# EAGLE design ng-beacon-mdbt42 (EAGLE 7.6.0)
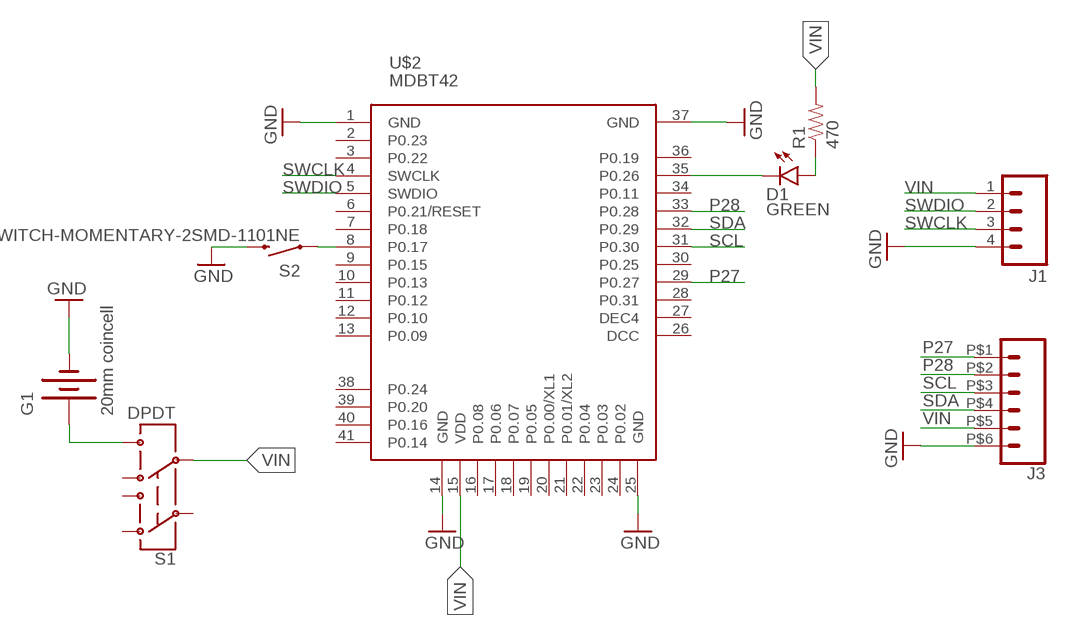
[diagram p0: schematic, sheet 1]

## Parts
D1  GREEN  LED-GREEN0603  [LED-0603]
G1  20mm coincell  BATTERY20MM_4LEGS  [BATTCON_20MM_4LEGS]
J1  M04LOCK  [1X04_LOCK]
J3  CONN_06  [PROTO4X6]
R1  470  470OHM1/10W1%(0603)  [0603-RES]
S1  DPDT  SWITCH-DPDTAYZ0202  [AYZ0202]
S2  SWITCH-MOMENTARY-2SMD-1101NE  [TACTILE-SWITCH-1101NE]
U$2  MDBT42  [MDBT42]

## Nets
GND: G1.NEGATIVE(-) J1.4 J3.P$6 S2.2 U$2.1(GND) U$2.14(GND) U$2.25(GND) U$2.37(GND)
N$1: G1.POSITIVE@1(+) G1.POSITIVE@2(+) G1.POSITIVE@3(+) G1.POSITIVE@4(+) S1.6
N$4: S2.1 U$2.8(P0.17)
N$7: D1.C U$2.35(P0.26)
N$8: D1.A R1.1
P27: J3.P$1 U$2.29(P0.27)
P28: J3.P$2 U$2.33(P0.28)
SCL: J3.P$3 U$2.31(P0.30)
SDA: J3.P$4 U$2.32(P0.29)
SWCLK: J1.3 U$2.4(SWCLK)
SWDIO: J1.2 U$2.5(SWDIO)
VIN: J1.1 J3.P$5 R1.2 S1.5 U$2.15(VDD)
Unconnected: S1.1 S1.2 S1.3 S1.4 U$2.2(P0.23) U$2.3(P0.22) U$2.6(P0.21/RESET) U$2.7(P0.18) U$2.9(P0.15) U$2.10(P0.13) U$2.11(P0.12) U$2.12(P0.10) U$2.13(P0.09) U$2.16(P0.08) U$2.17(P0.06) U$2.18(P0.07) U$2.19(P0.05) U$2.20(P0.00/XL1) U$2.21(P0.01/XL2) U$2.22(P0.04) U$2.23(P0.03) U$2.24(P0.02) U$2.26(DCC) U$2.27(DEC4) U$2.28(P0.31) U$2.30(P0.25) U$2.34(P0.11) U$2.36(P0.19) U$2.38(P0.24) U$2.39(P0.20) U$2.40(P0.16) U$2.41(P0.14)

## Library data of the parts
D1 = SparkFun-LED:LED-GREEN: Various green LEDs Green LEDs used in SFE Production 0603- DIO-00821 LARGE- DIO-00862 LILYPAD- DIO-09910; PROD_ID: DIO-00821
G1 = ng-beacon:BATTERY: Battery Holders Various common sizes : AA, AAA, 18650 (PRT-12895), 20mm coin cell and 12mm coin cell. 20MM_4LEGS, BATT-10373; PROD_ID: BATT-10373
J1 = SparkFun-Connectors:M04: Header 4 Standard 4-pin 0.1" header. Use with straight break away headers (SKU : PRT-00116), right angle break away headers (PRT-00553), swiss pins (PRT-00743), machine pins (PRT-00117), and female headers (PRT-00115). Molex polarized connector foot print use with SKU : PRT-08231 with associated crimp pins and housings. 1MM SMD Version SKU: PRT-10208; PROD_ID: CONN-09696
J3 = ng-beacon:CONN_06: Multi connection point. Often used as Generic Header-pin footprint for 0.1 inch spaced/style header connections On any of the 0.1 inch spaced packages, you can populate with these: Break Away Headers - Straight <https://www.sparkfun.com/products/116> (PRT-00116) Break Away Male Headers - Right Angle <https://www.sparkfun.com/products/553> (PRT-00553) Female Headers <https://www.sparkfun.com/products/115> (PRT-00115) Break Away Headers - Machine Pin <https://www.sparkfun.com/products/117> (PRT-00117) Break Away Female Headers - Swiss Machine Pin <https://www.sparkfun.com/products/743> (PRT-00743) Arduino Stackable Header - 6 Pin <https://www.sparkfun.com/products/9280> (PRT-09280) For SCREWTERMINALS and SPRING TERMINALS visit here: Screw Terimnals on SparkFun.com <https://www.sparkfun.com/search/results?term=Screw+Terminals> (5mm/3.5mm/2.54mm spacing) This device is also useful as a general connection point to wire up your design to another part of your project. Our various solder wires solder well into these plated through hole pads. Hook-Up Wire - Assortment (Stranded, 22 AWG) <https://www.sparkfun.com/products/11375> (PRT-11375) Hook-Up Wire - Assortment (Solid Core, 22 AWG) <https://www.sparkfun.com/products/11367> (PRT-11367) View the entire wire category on our website here <https://www.sparkfun.com/categories/141>
R1 = SparkFun-Resistors:470OHM1/10W1%(0603): RES-07869; PROD_ID: RES-07869
S1 = ng-beacon:SWITCH-DPDT: DPDT Version of the COM-00597; PROD_ID: SWCH-08179
S2 = SparkFun-Electromechanical:SWITCH-MOMENTARY-2: Various NO switches- pushbuttons, reed, etc; PROD_ID: SWCH-00815
U$2 = MDBT42:MDBT42: Raytac Corporation MDBT42-512K, MDBT42-P512K Bluetooth Low Energy Module based on Noridc nRF52832 Source: Raytac datasheet

## Board
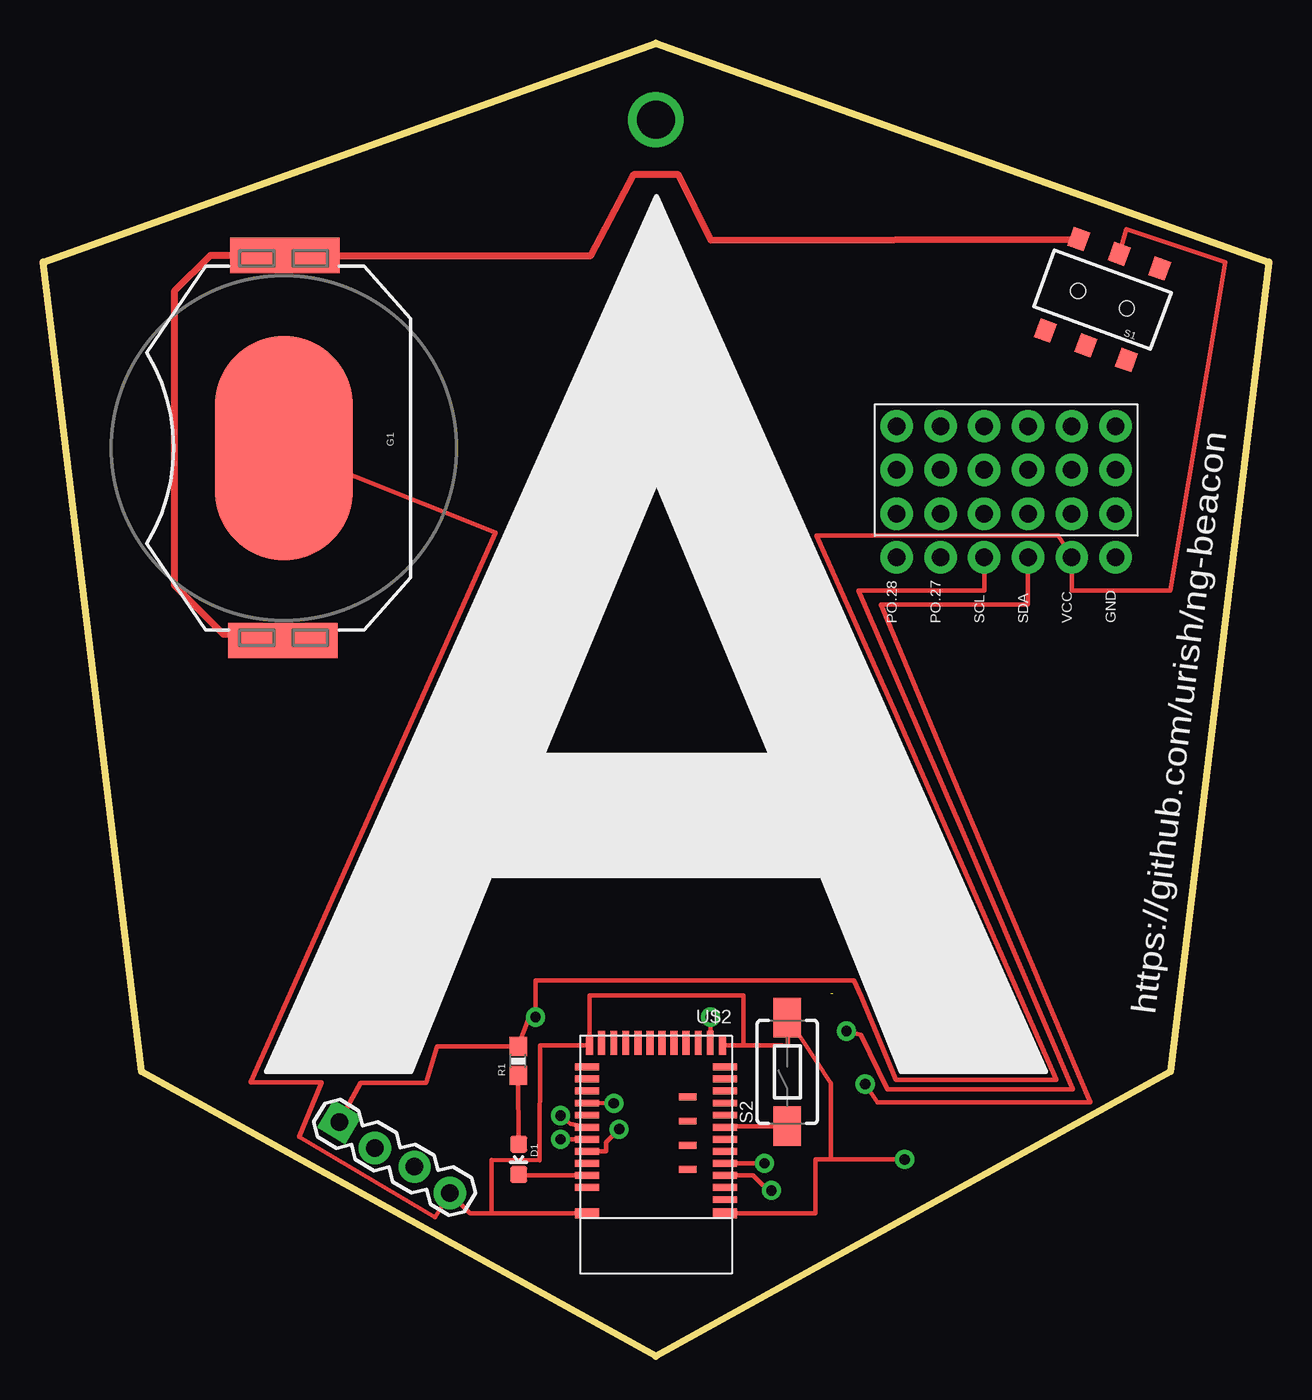
[diagram p1: board, top side]
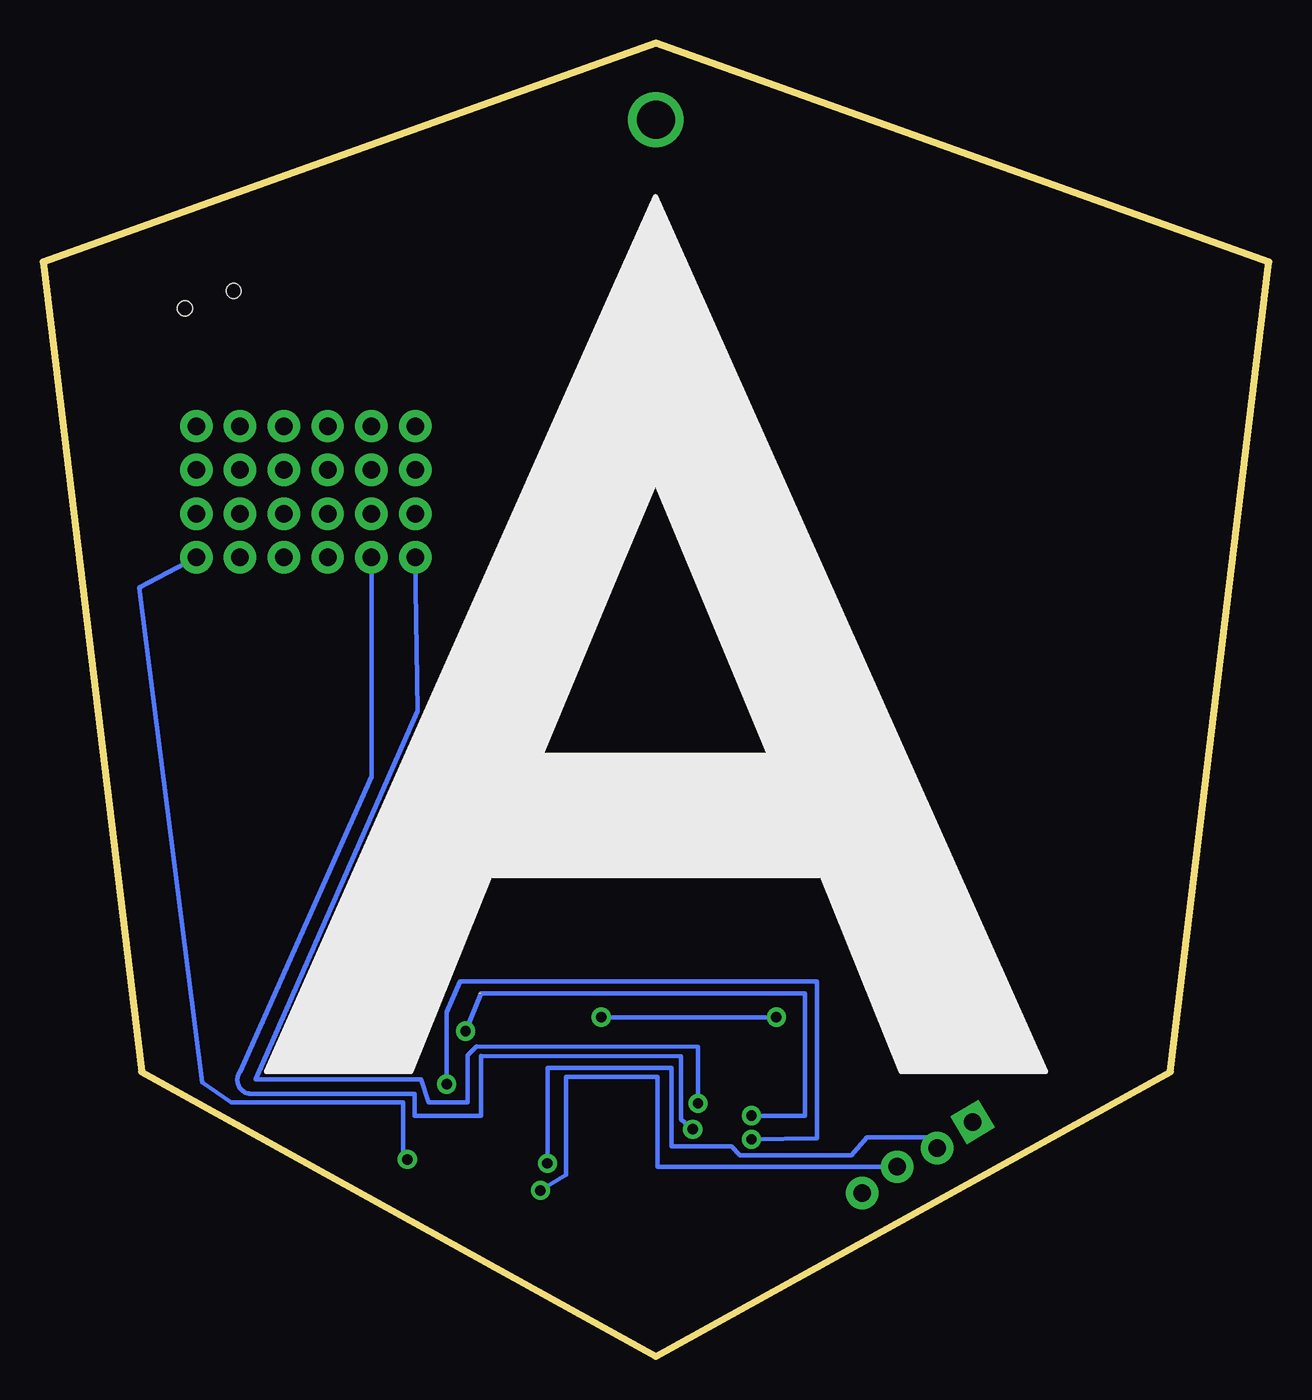
[diagram p2: board, bottom side, seen from below]

Size 71.12 x 76.2 mm. Coordinates in mm from the lower left corner, seen from the top.
Outline: 0,63.5 35.56,76.2 71.12,63.5 65.41,16.51 35.56,0 5.71,16.51 0,63.5
Copper layers (1*16): Top 0.035mm / dielectric 1.5mm / Bottom 0.035mm
Design rules "SparkFun-2-layer-STANDARD *": minimum track width 10mil, minimum drill 20mil, track to track 10mil, track to pad 8mil, pad to pad 8mil, via to via 10mil, smd to smd 8mil, copper to edge 8mil, drill to drill 8mil, minimum pad ring 10mil, minimum via ring 10mil, stop-mask expansion 4mil, vias tented up to drill 25mil, thermal gap 10mil

### Footprints (pad centres in the part's own frame; a part is rotated, then mirrored left to right if it is on the bottom)
LED-0603 = smd 1 x 1: A 0,-0.877; C 0,0.877
BATTCON_20MM_4LEGS = smd 13 x 8: NEGATIVE 0,0 | smd 2.032 x 3.175: POSITIVE@1 -11.176,1.651; POSITIVE@2 -11.176,-1.524; POSITIVE@3 11.176,1.524; POSITIVE@4 11.176,-1.651
1X04_LOCK = drill 1.016 pad 1.88 square: 1 0,0.127 | drill 1.016 pad 1.88: 2 2.54,-0.127; 3 5.08,0.127; 4 7.62,-0.127
PROTO4X6 = drill 1.016 pad 1.88: P$1 0,0; P$2 0,-2.54; P$3 0,-5.08; P$4 0,-7.62; P$5 0,-10.16; P$6 0,-12.7; P$7 2.54,0; P$8 2.54,-2.54; P$9 2.54,-5.08; P$10 2.54,-7.62; P$11 2.54,-10.16; P$12 2.54,-12.7; P$13 5.08,0; P$14 5.08,-2.54; P$15 5.08,-5.08; P$16 5.08,-7.62; P$17 5.08,-10.16; P$18 5.08,-12.7; P$19 7.62,0; P$20 7.62,-2.54; P$21 7.62,-5.08; P$22 7.62,-7.62; P$23 7.62,-10.16; P$24 7.62,-12.7
0603-RES = smd 1.1 x 1: 1 -0.85,0; 2 0.85,0
AYZ0202 = smd 1 x 1.15: 1 -2.5,2.825; 2 0,2.825; 3 2.5,2.825; 4 -2.5,-2.825; 5 0,-2.825; 6 2.5,-2.825 | hole 0.85: 1.5,0; -1.5,0
TACTILE-SWITCH-1101NE = smd 2.3 x 1.6: 1 -3.15,0; 2 3.15,0
MDBT42 = smd 1.4 x 0.6: 1 -4,4.4; 37 4,4.4 | smd 1.4 x 0.4: 2 -4,3.6; 3 -4,2.9; 4 -4,2.2; 5 -4,1.5; 6 -4,0.8; 7 -4,0.1; 8 -4,-0.6; 9 -4,-1.3; 10 -4,-2; 11 -4,-2.7; 12 -4,-3.4; 13 -4,-4.1; 26 4,-4.1; 27 4,-3.4; 28 4,-2.7; 29 4,-2; 30 4,-1.3; 31 4,-0.6; 32 4,0.1; 33 4,0.8; 34 4,1.5; 35 4,2.2; 36 4,2.9 | smd 0.4 x 1.1: 14 -3.85,-5.35; 25 3.85,-5.35 | smd 0.4 x 1.4: 15 -3.15,-5.5; 16 -2.45,-5.5; 17 -1.75,-5.5; 18 -1.05,-5.5; 19 -0.35,-5.5; 20 0.35,-5.5; 21 1.05,-5.5; 22 1.75,-5.5; 23 2.45,-5.5; 24 3.15,-5.5 | smd 1 x 0.4: 38 -1.85,1.85; 39 -1.85,0.45; 40 -1.85,-0.95; 41 -1.85,-2.35

### Placement (x,y rotation side)
D1  27.6,11.43 180 top
G1  13.97,52.71 270 top
J1  17.13,13.49 329.2 top
J3  49.53,46.36 90 top
R1  27.57,17.14 90 top
S1  61.47,61.32 160 top
S2  43.18,16.51 90 top
U$2  35.56,12.7 180 top

### Tracks (layer width: path | path; a pad name or v marks a point on that pad's centre or on a via)
GND  (via drill 0.6)
  Top 0.254: 40.64,18.05 42.91,18.05 43.23,18.01 S2.2 45.72,15.85 45.72,11.43 | 40.64,18.05 U$2.14 39.37,18.09 | 40.64,18.05 40.64,20.95 31.71,20.95 U$2.25 28.83,18.06 28.8,11.38 26.04,11.4 26.04,8.3 | 39.56,8.26 U$2.1 44.81,8.31 44.81,11.43 45.72,11.43 | 31.51,8.26 U$2.37 26.04,8.3 | 26.04,8.3 24.76,8.3 J1.4 22.73,8.08 14.86,12.75 16.15,15.9 12.04,15.9 26.26,47.8 G1.NEGATIVE | v49.99,11.43 45.72,11.43
  Bottom 0.254: J3.P$6 65.53,44.6 61.9,15.9 60.2,14.73 50.24,14.73 50.24,11.43 v49.99,11.43
N$1
  Top 0.254: G1.POSITIVE@2 16.51,63.88
  Top 0.406: S1.6 38.73,64.77 36.83,68.58 34.29,68.58 31.79,63.88 16.51,63.88 G1.POSITIVE@1 G1.POSITIVE@2 9.7,63.88 7.62,61.8 7.62,44.75 10.46,41.91 12.07,41.91 12.07,41.28 12.7,41.28 | 12.7,41.28 12.7,41.91 12.32,41.91 G1.POSITIVE@4 | 12.7,41.28 15.49,41.28 G1.POSITIVE@3
N$3  (via drill 2.2)
  other vias: 35.56,71.75
N$4
  Top 0.254: S2.1 43.18,13.33 39.59,13.33 U$2.8
N$7
  Top 0.254: U$2.35 27.5,10.5 D1.C
N$8
  Top 0.254: R1.1 D1.A
P27  (via drill 0.6)
  Top 0.254: U$2.29 v33.12,14.68
  Bottom 0.254: J3.P$1 49.4,37.44 58.8,16.08 49.2,16.08 48.74,14.73 46.48,14.73 46.48,17.45 45.98,17.98 33.12,17.96 v33.12,14.68
P28  (via drill 0.6)
  Top 0.254: v33.43,13.18 32.66,12.42 32.66,11.91 32.65,11.9 U$2.33
  Bottom 0.254: J3.P$2 52.07,33.66 59.69,16.51 arc-127 59.06,15.24 49.56,15.24 49.56,13.97 45.72,13.97 45.72,17.42 34.11,17.4 34.11,13.74 v33.43,13.18
SCL  (via drill 0.6)  (1 unrouted)
  Top 0.254: U$2.31 30.61,13.49 v30.02,13.97 | v46.61,18.87 47.45,18.64 49,15.49 59.74,15.49 53.34,30.48 52.43,32.54 47.32,44.45 54.61,44.45 J3.P$3
  Bottom 0.254: v30.02,13.97 26.92,13.97 26.92,21.06 45.72,21.06 v46.61,18.87
SDA  (via drill 0.6)
  Top 0.254: U$2.32 v30.02,12.6 | J3.P$4 57.15,43.64 48.62,43.64 52.91,33.33 60.17,16.1 60.76,14.73 48.41,14.73 v47.7,15.8
  Bottom 0.254: v30.02,12.6 26.21,12.65 26.21,21.77 46.91,21.77 47.7,19.96 v47.7,15.8
SWCLK  (via drill 0.6)
  Top 0.254: U$2.4 41.2,10.5 41.77,9.93 41.96,9.93 v42.27,9.63
  Bottom 0.254: v42.27,9.63 40.77,10.54 40.77,16.21 35.48,16.21 35.48,11 J1.3
SWDIO  (via drill 0.6)
  Top 0.254: U$2.5 v41.86,11.2
  Bottom 0.254: v41.86,11.2 41.86,16.74 34.67,16.74 34.67,12.19 31.19,12.19 30.68,11.66 24.21,11.66 23.32,12.7 19.86,12.7 J1.2
VIN  (via drill 0.6)
  Top 0.254: U$2.15 v38.73,19.68 | S1.5 62.87,65.41 68.58,63.5 65.41,44.45 59.69,44.45 J3.P$5 58.9,47.62 44.88,47.62 49.4,37.49 58.8,16.05 49.48,16.05 47.47,20.87 47.04,21.82 28.57,21.82 v28.57,19.68 28.21,19.68 R1.2 22.86,18 22.22,15.88 18.41,15.88 J1.1
  Bottom 0.254: v38.73,19.68 v28.57,19.68

### Text on the board
tNames: PO.28 | PO.27 | SCL | SDA | VCC | GND | https://github.com/urish/ng-beacon